# EAGLE design M220at (EAGLE 6.6.0)
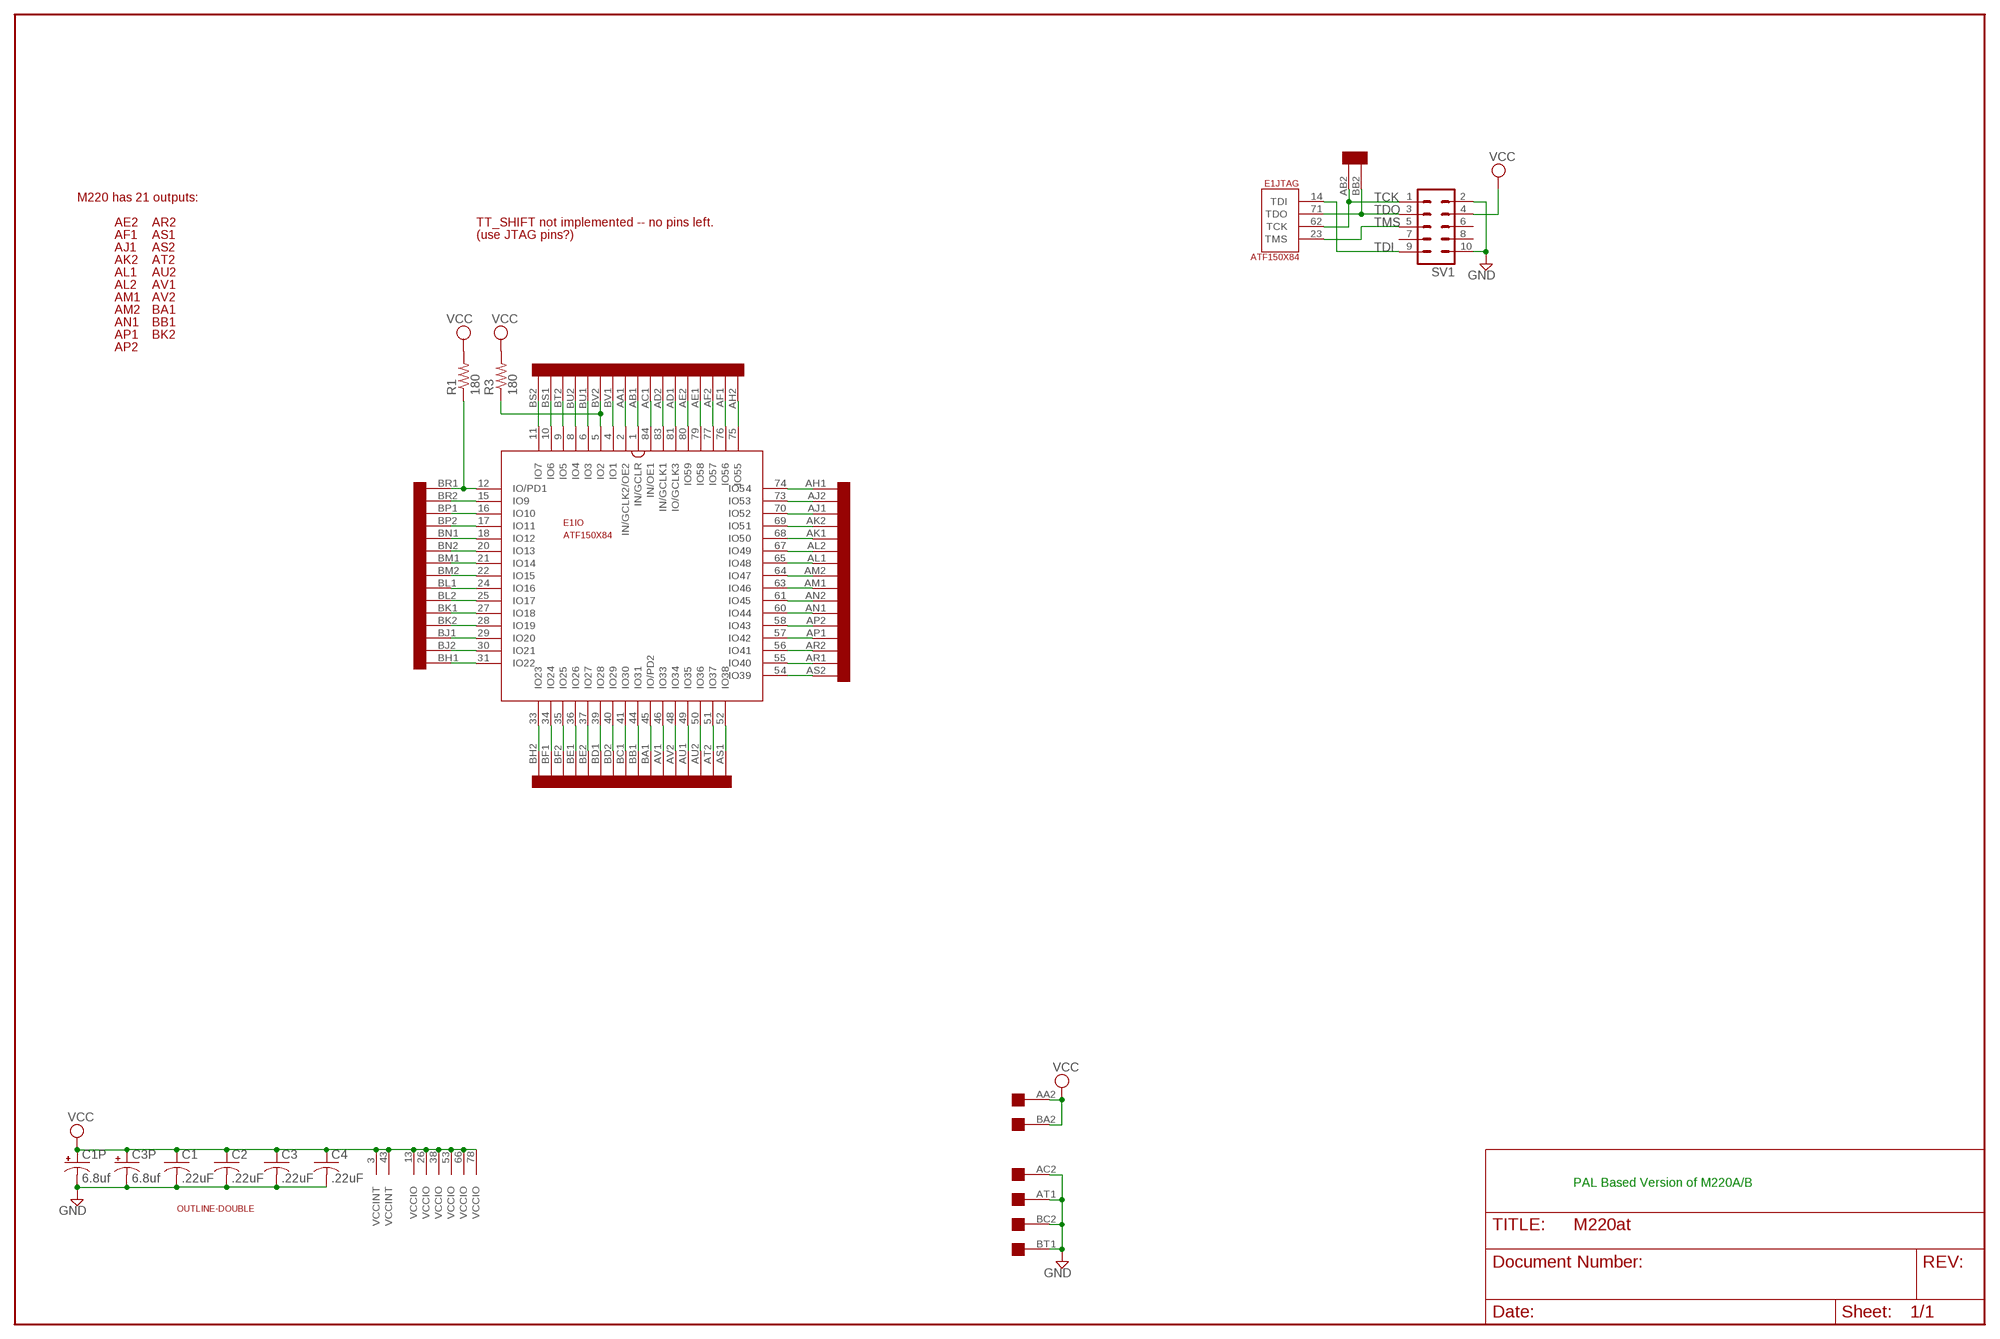
[diagram p0: schematic, sheet 1]

## Parts
C1  .22uF  C-US050-025X075  [C050-025X075]
C1P  6.8uf  CPOL-USE15-5AXIAL  [E15-5]
C2  .22uF  C-US050-025X075  [C050-025X075]
C3  .22uF  C-US050-025X075  [C050-025X075]
C3P  6.8uf  CPOL-USE15-5AXIAL  [E15-5]
C4  .22uF  C-US050-025X075  [C050-025X075]
E1  ATF150X84  [S84]
R1  180  R-US_0207/10  [0207/10]
R3  180  R-US_0207/10  [0207/10]
SV1  ML10  [ML10]
U$1  DOUBLE  [EDGE-CON4]
U$2  OUTLINE-DOUBLE  [DOUBLE]

## Nets
AA1: E1.2(IO:IN/GCLK2/OE2) U$1.AA1
AB1: E1.1(IO:IN/GCLR) U$1.AB1
AC1: E1.84(IO:IN/OE1) U$1.AC1
AD1: E1.81(IO:IO/GCLK3) U$1.AD1
AD2: E1.83(IO:IN/GCLK1) U$1.AD2
AE1: E1.79(IO:IO58) U$1.AE1
AE2: E1.80(IO:IO59) U$1.AE2
AF1: E1.76(IO:IO56) U$1.AF1
AF2: E1.77(IO:IO57) U$1.AF2
AH1: E1.74(IO:IO54) U$1.AH1
AH2: E1.75(IO:IO55) U$1.AH2
AJ1: E1.70(IO:IO52) U$1.AJ1
AJ2: E1.73(IO:IO53) U$1.AJ2
AK1: E1.68(IO:IO50) U$1.AK1
AK2: E1.69(IO:IO51) U$1.AK2
AL1: E1.65(IO:IO48) U$1.AL1
AL2: E1.67(IO:IO49) U$1.AL2
AM1: E1.63(IO:IO46) U$1.AM1
AM2: E1.64(IO:IO47) U$1.AM2
AN1: E1.60(IO:IO44) U$1.AN1
AN2: E1.61(IO:IO45) U$1.AN2
AP1: E1.57(IO:IO42) U$1.AP1
AP2: E1.58(IO:IO43) U$1.AP2
AR1: E1.55(IO:IO40) U$1.AR1
AR2: E1.56(IO:IO41) U$1.AR2
AS1: E1.52(IO:IO38) U$1.AS1
AS2: E1.54(IO:IO39) U$1.AS2
AT2: E1.51(IO:IO37) U$1.AT2
AU1: E1.49(IO:IO35) U$1.AU1
AU2: E1.50(IO:IO36) U$1.AU2
AV1: E1.46(IO:IO33) U$1.AV1
AV2: E1.48(IO:IO34) U$1.AV2
BA1: E1.45(IO:IO/PD2) U$1.BA1
BB1: E1.44(IO:IO31) U$1.BB1
BC1: E1.41(IO:IO30) U$1.BC1
BD1: E1.39(IO:IO28) U$1.BD1
BD2: E1.40(IO:IO29) U$1.BD2
BE1: E1.36(IO:IO26) U$1.BE1
BE2: E1.37(IO:IO27) U$1.BE2
BF1: E1.34(IO:IO24) U$1.BF1
BF2: E1.35(IO:IO25) U$1.BF2
BH1: E1.31(IO:IO22) U$1.BH1
BH2: E1.33(IO:IO23) U$1.BH2
BJ1: E1.29(IO:IO20) U$1.BJ1
BJ2: E1.30(IO:IO21) U$1.BJ2
BK1: E1.27(IO:IO18) U$1.BK1
BK2: E1.28(IO:IO19) U$1.BK2
BL1: E1.24(IO:IO16) U$1.BL1
BL2: E1.25(IO:IO17) U$1.BL2
BM1: E1.21(IO:IO14) U$1.BM1
BM2: E1.22(IO:IO15) U$1.BM2
BN1: E1.18(IO:IO12) U$1.BN1
BN2: E1.20(IO:IO13) U$1.BN2
BP1: E1.16(IO:IO10) U$1.BP1
BP2: E1.17(IO:IO11) U$1.BP2
BR1: E1.12(IO:IO/PD1) R1.1 U$1.BR1
BR2: E1.15(IO:IO9) U$1.BR2
BS1: E1.10(IO:IO6) U$1.BS1
BS2: E1.11(IO:IO7) U$1.BS2
BT2: E1.9(IO:IO5) U$1.BT2
BU1: E1.6(IO:IO3) U$1.BU1
BU2: E1.8(IO:IO4) U$1.BU2
BV1: E1.4(IO:IO1) U$1.BV1
BV2: E1.5(IO:IO2) R3.1 U$1.BV2
GND [Supply]: C1.2 C1P.- C2.2 C3.2 C3P.- C4.2 SV1.2 SV1.10 U$1.AC2 U$1.AT1 U$1.BC2 U$1.BT1
TCK: E1.62(JTAG:TCK) SV1.1 U$1.AB2
TDI: E1.14(JTAG:TDI) SV1.9
TDO: E1.71(JTAG:TDO) SV1.3 U$1.BB2
TMS: E1.23(JTAG:TMS) SV1.5
VCC [Supply]: C1.1 C1P.+ C2.1 C3.1 C3P.+ C4.1 E1.3(VCCINT) E1.13(VCCIO) E1.26(VCCIO) E1.38(VCCIO) E1.43(VCCINT) E1.53(VCCIO) E1.66(VCCIO) E1.78(VCCIO) R1.2 R3.2 SV1.4 U$1.AA2 U$1.BA2
Unconnected: SV1.6 SV1.7 SV1.8

## Notes on the sheet
- M220 has 21 outputs:
- AE2 | AR2 | TT_SHIFT not implemented -- no pins left.
- AF1 | AS1 | (use JTAG pins?)
- AJ1 | AS2
- AK2 | AT2
- AL1 | AU2
- AL2 | AV1
- AM1 | AV2
- AM2 | BA1
- AN1 | BB1
- AP1 | BK2
- AP2
- PAL Based Version of M220A/B

## Power pins joined to a net without a drawn wire
GND: E1.7(GND) E1.19(GND) E1.32(GND) E1.42(GND) E1.47(GND) E1.59(GND) E1.72(GND) E1.82(GND)

## Library data of the parts
C1-C4 = rcl:C-US: CAPACITOR, American symbol
C1P C3P = rcl:CPOL-US: POLARIZED CAPACITOR, American symbol
E1 = atmel-cpld:ATF150X84: ATF150x in 84 pin package.
R1 R3 = rcl:R-US_: RESISTOR, American symbol
SV1 = con-harting-ml:ML10: HARTING; OC_FARNELL: unknown; OC_NEWARK: unknown
U$1 = dec-con:DOUBLE: Double-Height DEC board
U$2 = dec-con:OUTLINE-*: Board outlines for DEC boards.

## Net classes
1 Supply: width 0.711 mm

## Board
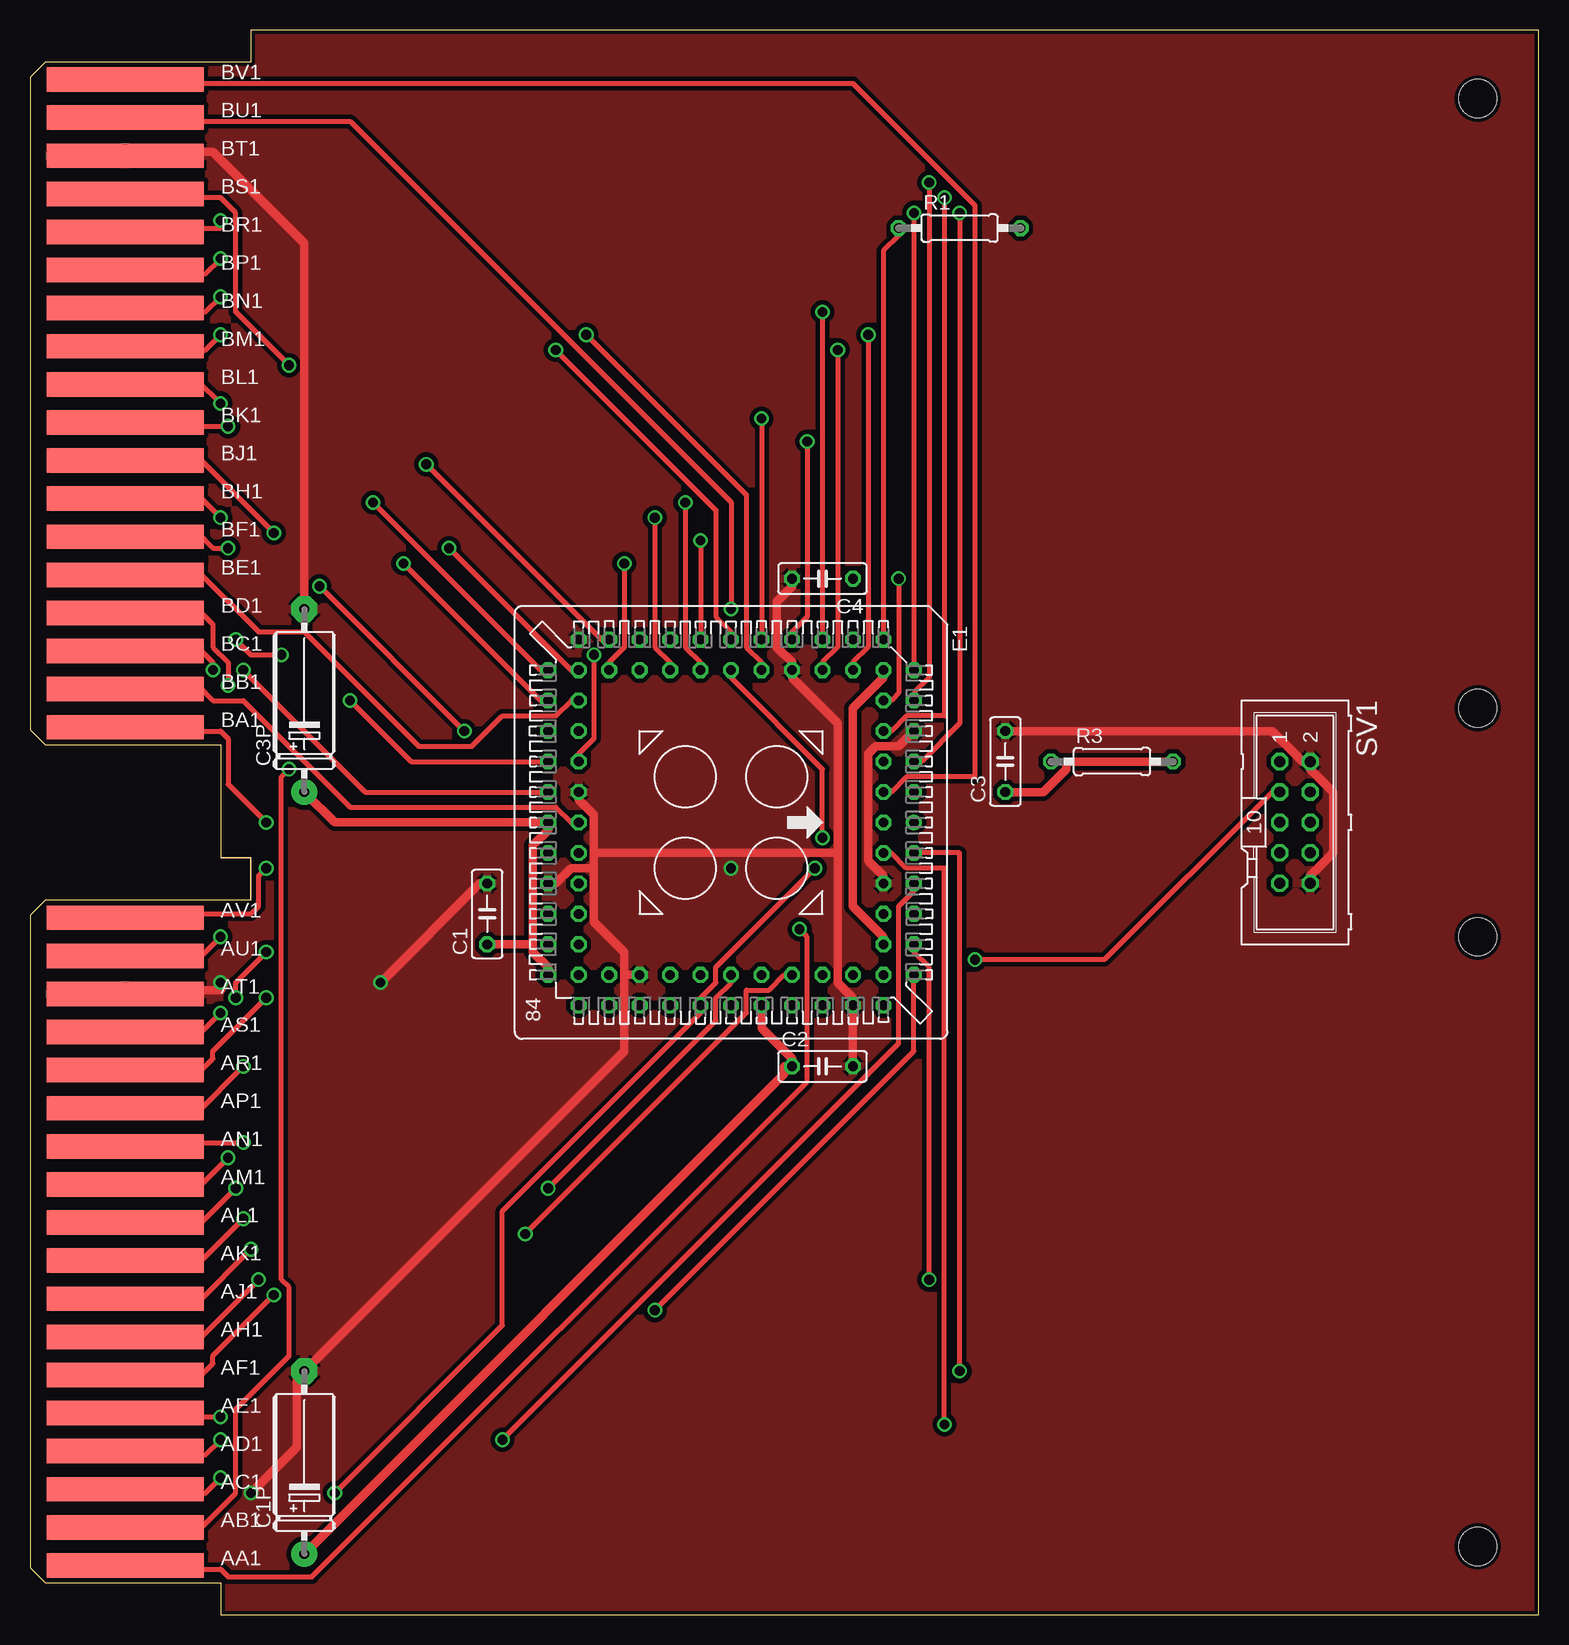
[diagram p1: board, top side]
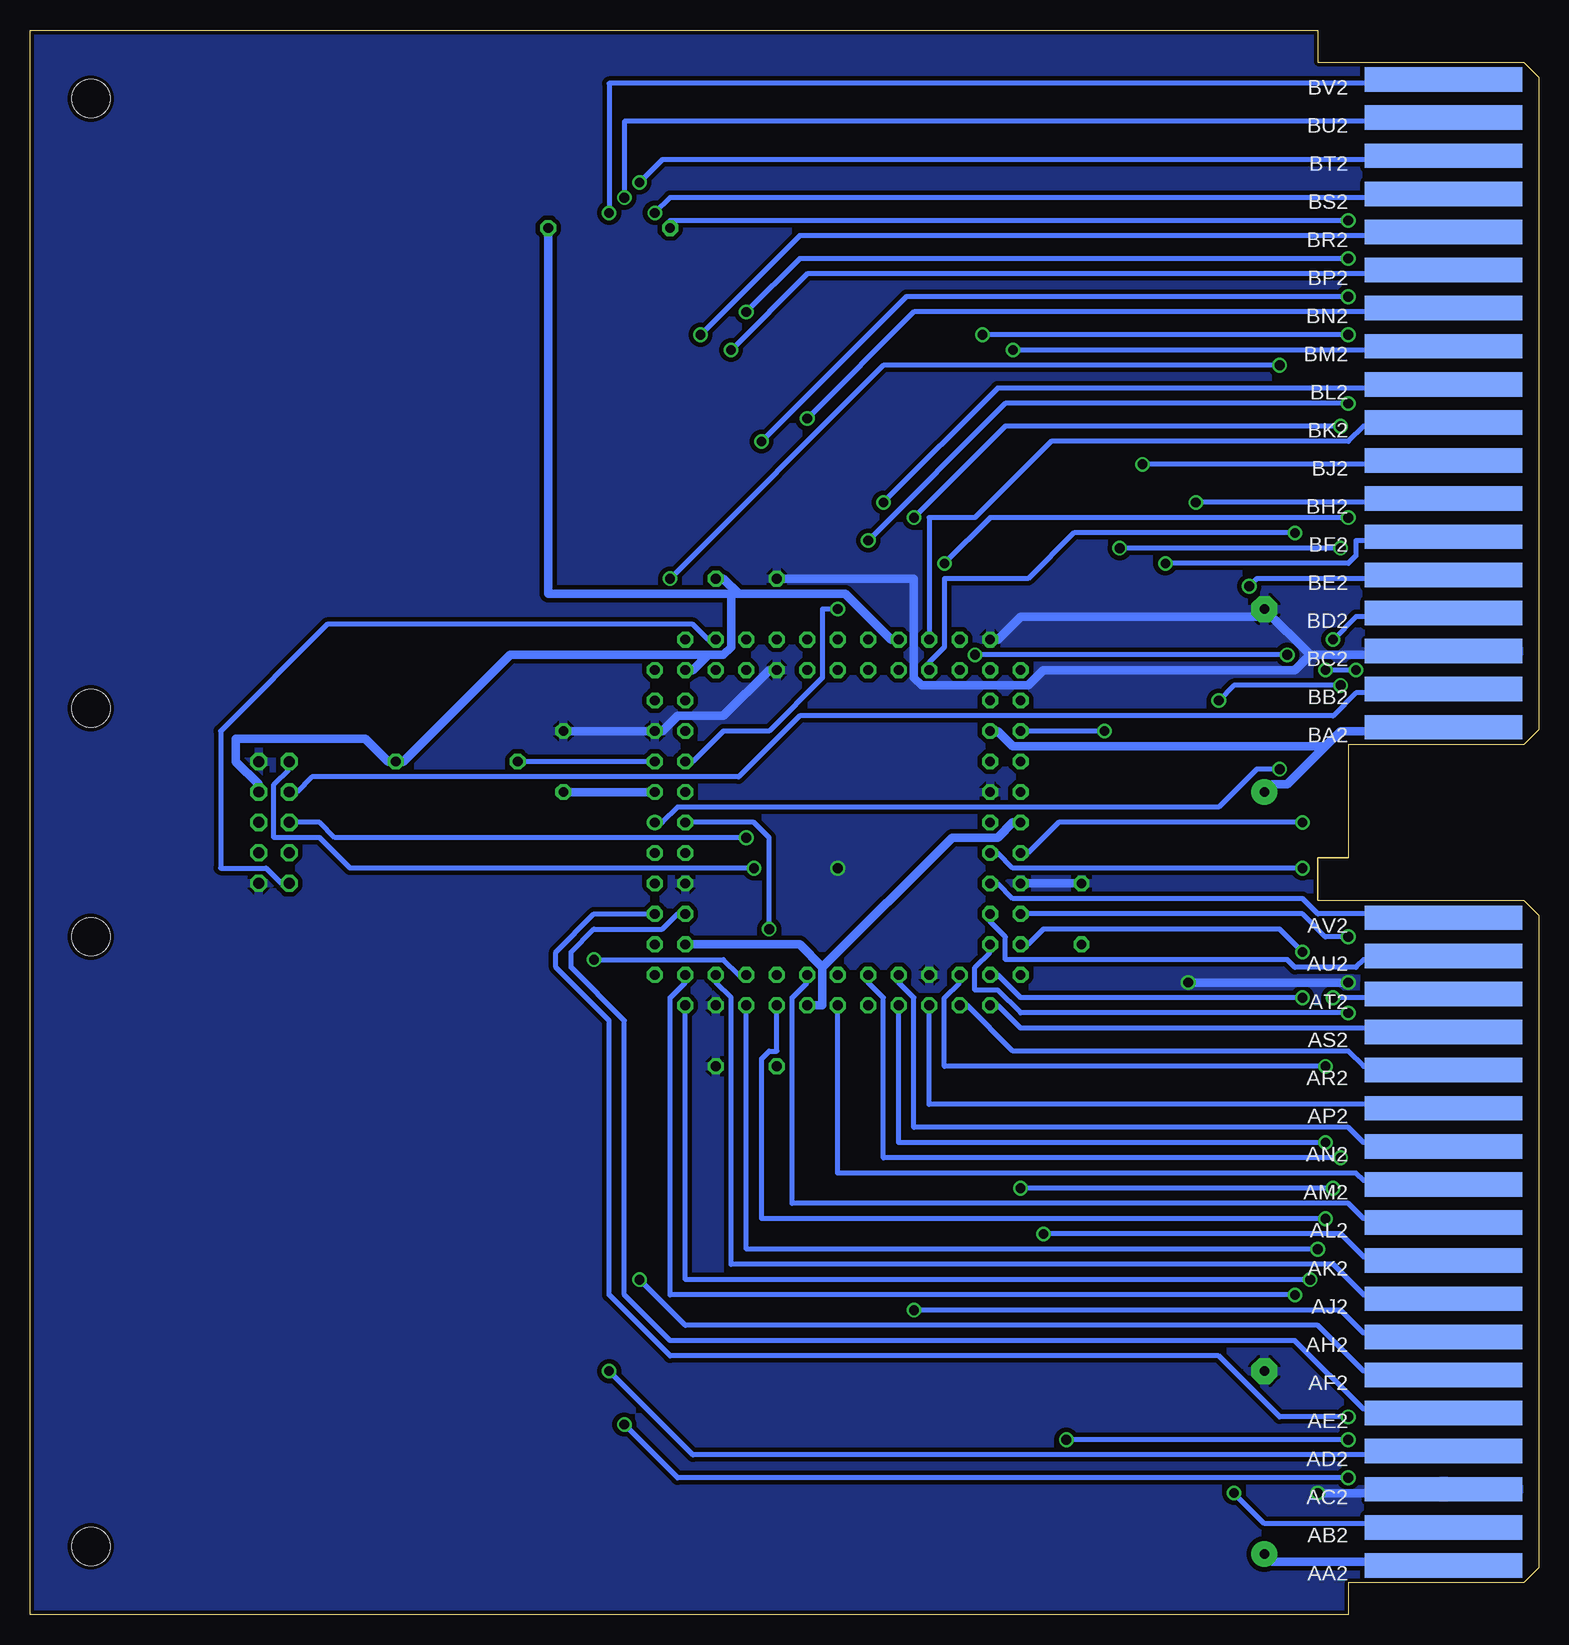
[diagram p2: board, bottom side, seen from below]

Size 125.73 x 132.08 mm. Coordinates in mm from the lower left corner, seen from the top.
Copper layers (1+16): Top 0.035mm / dielectric 1.5mm / Bottom 0.035mm
Design rules "16mils": minimum track width 16mil, minimum drill 32mil, track to track 15mil, track to pad 10mil, pad to pad 10mil, via to via 10mil, smd to smd 10mil, copper to edge 13mil, drill to drill 10mil, minimum pad ring 10mil, minimum via ring 8mil, stop-mask expansion 0mil, vias tented up to drill 0mil, thermal gap 10mil

### Footprints (pad centres in the part's own frame; a part is rotated, then mirrored left to right if it is on the bottom)
C050-025X075 = drill 0.813 octagon: 1 -2.54,0; 2 2.54,0
E15-5 = drill 0.813 pad 2.159: + -7.62,0 | drill 0.813 pad 2.159 octagon: - 7.62,0
S84 = drill 0.813: 1 0,15.24 | drill 0.813 octagon: 2 0,12.7; 3 -2.54,15.24; 4 -2.54,12.7; 5 -5.08,15.24; 6 -5.08,12.7; 7 -7.62,15.24; 8 -7.62,12.7; 9 -10.16,15.24; 10 -10.16,12.7; 11 -12.7,15.24; 12 -15.24,12.7; 13 -12.7,12.7; 14 -15.24,10.16; 15 -12.7,10.16; 16 -15.24,7.62; 17 -12.7,7.62; 18 -15.24,5.08; 19 -12.7,5.08; 20 -15.24,2.54; 21 -12.7,2.54; 22 -15.24,0; 23 -12.7,0; 24 -15.24,-2.54; 25 -12.7,-2.54; 26 -15.24,-5.08; 27 -12.7,-5.08; 28 -15.24,-7.62; 29 -12.7,-7.62; 30 -15.24,-10.16; 31 -12.7,-10.16; 32 -15.24,-12.7; 33 -12.7,-15.24; 34 -12.7,-12.7; 35 -10.16,-15.24; 36 -10.16,-12.7; 37 -7.62,-15.24; 38 -7.62,-12.7; 39 -5.08,-15.24; 40 -5.08,-12.7; 41 -2.54,-15.24; 42 -2.54,-12.7; 43 0,-15.24; 44 0,-12.7; 45 2.54,-15.24; 46 2.54,-12.7; 47 5.08,-15.24; 48 5.08,-12.7; 49 7.62,-15.24; 50 7.62,-12.7; 51 10.16,-15.24; 52 10.16,-12.7; 53 12.7,-15.24; 54 15.24,-12.7; 55 12.7,-12.7; 56 15.24,-10.16; 57 12.7,-10.16; 58 15.24,-7.62; 59 12.7,-7.62; 60 15.24,-5.08; 61 12.7,-5.08; 62 15.24,-2.54; 63 12.7,-2.54; 64 15.24,0; 65 12.7,0; 66 15.24,2.54; 67 12.7,2.54; 68 15.24,5.08; 69 12.7,5.08; 70 15.24,7.62; 71 12.7,7.62; 72 15.24,10.16; 73 12.7,10.16; 74 15.24,12.7; 75 12.7,15.24; 76 12.7,12.7; 77 10.16,15.24; 78 10.16,12.7; 79 7.62,15.24; 80 7.62,12.7; 81 5.08,15.24; 82 5.08,12.7; 83 2.54,15.24; 84 2.54,12.7
0207/10 = drill 0.813 octagon: 1 -5.08,0; 2 5.08,0
ML10 = drill 0.914 octagon: 1 -5.08,-1.27; 2 -5.08,1.27; 3 -2.54,-1.27; 4 -2.54,1.27; 5 0,-1.27; 6 0,1.27; 7 2.54,-1.27; 8 2.54,1.27; 9 5.08,-1.27; 10 5.08,1.27
EDGE-CON4 = smd 13.106 x 2.032: AA1 7.938,4.128; AB1 7.938,7.303; AC1 7.938,10.477; AD1 7.938,13.652; AE1 7.938,16.828; AF1 7.938,20.003; AH1 7.938,23.177; AJ1 7.938,26.352; AK1 7.938,29.527; AL1 7.938,32.703; AM1 7.938,35.877; AN1 7.938,39.053; AP1 7.938,42.227; AR1 7.938,45.403; AS1 7.938,48.578; AT1 7.938,51.752; AU1 7.938,54.928; AV1 7.938,58.102; BA1 7.938,73.978; BB1 7.938,77.153; BC1 7.938,80.328; BD1 7.938,83.502; BE1 7.938,86.677; BF1 7.938,89.853; BH1 7.938,93.028; BJ1 7.938,96.203; BK1 7.938,99.377; BL1 7.938,102.552; BM1 7.938,105.728; BN1 7.938,108.903; BP1 7.938,112.078; BR1 7.938,115.252; BS1 7.938,118.427; BT1 7.938,121.603; BU1 7.938,124.778; BV1 7.938,127.953 | smd 13.106 x 2.032 bottom: AA2 7.938,4.128; AB2 7.938,7.303; AC2 7.938,10.477; AD2 7.938,13.652; AE2 7.938,16.828; AF2 7.938,20.003; AH2 7.938,23.177; AJ2 7.938,26.352; AK2 7.938,29.527; AL2 7.938,32.703; AM2 7.938,35.877; AN2 7.938,39.053; AP2 7.938,42.227; AR2 7.938,45.403; AS2 7.938,48.578; AT2 7.938,51.752; AU2 7.938,54.928; AV2 7.938,58.102; BA2 7.938,73.978; BB2 7.938,77.153; BC2 7.938,80.328; BD2 7.938,83.502; BE2 7.938,86.677; BF2 7.938,89.853; BH2 7.938,93.028; BJ2 7.938,96.203; BK2 7.938,99.377; BL2 7.938,102.552; BM2 7.938,105.728; BN2 7.938,108.903; BP2 7.938,112.078; BR2 7.938,115.252; BS2 7.938,118.427; BT2 7.938,121.603; BU2 7.938,124.778; BV2 7.938,127.953
DOUBLE = hole 3.175: 120.65,56.515; 120.65,5.715; 120.65,75.565; 120.65,126.365

### Placement (x,y rotation side)
C1  38.1,58.42 90 top
C1P  22.86,12.7 90 top
C2  66.04,45.72 0 top
C3  81.28,71.12 90 top
C3P  22.86,76.2 90 top
C4  66.04,86.36 180 top
E1  58.42,66.04 270 top
R1  77.47,115.57 0 top
R3  90.17,71.12 0 top
SV1  105.41,66.04 270 top
U$1  0,0 0 top
U$2  0,0 0 top

### Tracks (layer width: path | path; a pad name or v marks a point on that pad's centre or on a via)
AA1  (via drill 0.81)
  Top 0.406: v64.14,57.15 64.77,56.52 64.77,44.45 23.5,3.17 16.51,3.17 15.88,3.81 13.97,3.81 U$1.AA1
  Bottom 0.406: v64.14,57.15 64.14,64.77 65.41,66.04 E1.2
AB1  (via drill 0.81)
  Top 0.406: v21.59,70.48 20.96,69.85 20.96,27.94 21.59,27.3 21.59,21.59 17.15,17.14 17.15,10.16 13.97,6.99 U$1.AB1
  Bottom 0.406: v21.59,70.48 23.5,70.48 26.67,67.31 71.76,67.31 73.03,66.04 E1.1
AC1  (via drill 0.81)
  Top 0.406: v76.2,15.88 76.2,62.23 73.03,62.23 71.76,63.5 E1.84 | v15.88,11.43 14.61,10.16 13.97,10.16 U$1.AC1
  Bottom 0.406: v76.2,15.88 71.76,11.43 v15.88,11.43
AD1  (via drill 0.81)
  Top 0.406: v39.37,14.61 72.39,47.62 72.39,59.05 73.66,60.33 E1.81 | v15.88,14.61 14.61,13.34 13.97,13.34 U$1.AD1
  Bottom 0.406: v15.88,14.61 v39.37,14.61
AD2  (via drill 0.81)
  Top 0.406: v77.47,20.32 77.47,63.5 E1.83
  Bottom 0.406: v77.47,20.32 70.49,13.34 13.97,13.34 U$1.AD2
AE1  (via drill 0.81)
  Top 0.406: v15.88,16.51 13.97,16.51 U$1.AE1
  Bottom 0.406: v15.88,16.51 21.59,16.51 26.67,21.59 72.39,21.59 77.47,26.67 77.47,49.53 81.92,53.98 81.92,55.24 78.74,58.42 E1.79
AE2
  Bottom 0.406: E1.80 71.76,58.42 73.03,57.15 78.74,57.15 80.65,55.24 80.65,53.98 76.2,49.53 76.2,26.67 72.39,22.86 20.32,22.86 14.61,17.14 13.97,17.14 U$1.AE2
AF1  (via drill 0.81)
  Top 0.406: v20.32,26.67 15.24,21.59 15.24,20.95 13.97,19.68 U$1.AF1
  Bottom 0.406: v20.32,26.67 72.39,26.67 72.39,51.44 71.12,52.7 E1.76
AF2  (via drill 0.81)
  Top 0.406: v74.93,27.94 74.93,53.98 73.66,55.24 E1.77
  Bottom 0.406: v74.93,27.94 71.12,24.13 18.42,24.13 14.61,20.32 13.97,20.32 U$1.AF2
AH1  (via drill 0.81)
  Top 0.406: v19.05,27.94 13.97,22.86 U$1.AH1
  Bottom 0.406: v19.05,27.94 71.12,27.94 E1.74
AH2  (via drill 0.81)
  Top 0.406: v52.07,25.4 73.66,46.99 E1.75
  Bottom 0.406: v52.07,25.4 16.51,25.4 14.61,23.5 13.97,23.5 U$1.AH2
AJ1  (via drill 0.81)
  Top 0.406: v18.42,30.48 13.97,26.04 U$1.AJ1
  Bottom 0.406: v18.42,30.48 66.04,30.48 E1.70
AJ2
  Bottom 0.406: E1.73 68.58,52.7 67.31,51.44 67.31,29.21 17.15,29.21 14.61,26.67 13.97,26.67 U$1.AJ2
AK1  (via drill 0.81)
  Top 0.406: v17.78,33.02 13.97,29.21 U$1.AK1
  Bottom 0.406: v17.78,33.02 64.77,33.02 64.77,46.35 64.14,46.99 63.5,46.99 E1.68
AK2  (via drill 0.81)
  Top 0.406: v41.28,31.75 59.69,50.16 59.69,52.07 61.6,52.07 62.87,53.34 E1.69
  Bottom 0.406: v41.28,31.75 16.51,31.75 14.61,29.84 13.97,29.84 U$1.AK2
AL1  (via drill 0.81)
  Top 0.406: v43.18,35.56 57.15,49.53 57.15,51.44 58.42,52.7 E1.65 | v17.15,35.56 13.97,32.38 U$1.AL1
  Bottom 0.406: v17.15,35.56 v43.18,35.56
AL2
  Bottom 0.406: E1.67 60.96,52.7 62.23,51.44 62.23,34.29 15.88,34.29 14.61,33.02 13.97,33.02 U$1.AL2
AM1  (via drill 0.81)
  Top 0.406: v16.51,38.1 13.97,35.56 U$1.AM1
  Bottom 0.406: v16.51,38.1 54.61,38.1 54.61,51.44 55.88,52.7 E1.63
AM2
  Bottom 0.406: E1.64 58.42,36.83 15.24,36.83 14.61,36.2 13.97,36.2 U$1.AM2
AN1  (via drill 0.81)
  Top 0.406: v17.78,39.37 13.97,39.37 U$1.AN1
  Bottom 0.406: v17.78,39.37 53.34,39.37 E1.60
AN2
  Bottom 0.406: E1.61 53.34,52.7 52.07,51.44 52.07,40.64 15.88,40.64 14.61,39.37 13.97,39.37 U$1.AN2
AP1  (via drill 0.81)
  Top 0.406: v17.78,45.72 13.97,41.91 U$1.AP1
  Bottom 0.406: v17.78,45.72 49.53,45.72 49.53,51.44 48.26,52.7 E1.57
AP2
  Bottom 0.406: E1.58 50.8,42.55 13.97,42.55 U$1.AP2
AR1  (via drill 0.81)
  Top 0.406: v19.69,51.44 15.24,46.99 15.24,46.35 13.97,45.09 U$1.AR1
  Bottom 0.406: v19.69,51.44 43.18,51.44 45.09,53.34 E1.55
AR2
  Bottom 0.406: E1.56 47.63,50.8 43.82,46.99 15.88,46.99 14.61,45.72 13.97,45.72 U$1.AR2
AS1  (via drill 0.81)
  Top 0.406: v15.88,50.16 13.97,48.26 U$1.AS1
  Bottom 0.406: v15.88,50.16 43.18,50.16 45.09,52.07 46.99,52.07 46.99,53.98 45.72,55.24 E1.52
AS2
  Bottom 0.406: E1.54 45.09,50.8 43.18,48.9 13.97,48.9 U$1.AS2
AT2  (via drill 0.81)
  Top 0.406: v19.69,55.24 17.15,52.7 v17.15,51.44
  Bottom 0.406: v19.69,55.24 21.59,57.15 41.28,57.15 42.55,55.88 E1.51 | v17.15,51.44 13.97,51.44 U$1.AT2
AU1  (via drill 0.81)
  Top 0.406: v15.88,56.52 13.97,54.61 U$1.AU1
  Bottom 0.406: v15.88,56.52 17.78,56.52 19.69,58.42 E1.49
AU2
  Bottom 0.406: E1.50 45.72,57.78 44.45,56.52 44.45,54.61 20.96,54.61 20.32,53.98 15.24,53.98 14.61,54.61 13.97,54.61 U$1.AU2
AV1  (via drill 0.81)
  Top 0.406: v19.69,62.23 19.05,61.59 19.05,59.05 18.42,58.42 13.97,58.42 U$1.AV1
  Bottom 0.406: v19.69,62.23 43.82,62.23 45.09,63.5 E1.46
AV2
  Bottom 0.406: E1.48 45.09,60.96 43.82,59.69 19.69,59.69 18.42,58.42 13.97,58.42 U$1.AV2
BA1  (via drill 0.81)
  Top 0.406: v19.69,66.04 16.51,69.22 16.51,73.03 15.88,73.66 13.97,73.66 U$1.BA1
  Bottom 0.406: v19.69,66.04 40.01,66.04 42.55,63.5 E1.45
BB1
  Top 0.406: E1.44 45.09,66.04 43.82,67.31 26.67,67.31 17.78,76.2 15.24,76.2 13.97,77.47 U$1.BB1
BC1  (via drill 0.81)
  Top 0.406: v17.78,78.74 27.94,68.58 E1.41 | v15.24,78.74 15.24,79.38 13.97,80.64 U$1.BC1
  Bottom 0.406: v15.24,78.74 v17.78,78.74
BD1  (via drill 0.81)
  Top 0.406: v26.67,76.2 31.75,71.12 E1.39 | v16.51,77.47 16.51,79.38 15.24,80.64 15.24,82.55 13.97,83.82 U$1.BD1
  Bottom 0.406: v26.67,76.2 25.4,77.47 v16.51,77.47
BD2  (via drill 0.81)
  Top 0.406: v46.99,80.01 46.99,73.03 45.72,71.75 E1.40 | v20.96,80.01 18.42,80.01 v17.15,81.28
  Bottom 0.406: v20.96,80.01 v46.99,80.01 | v17.15,81.28 15.24,83.19 13.97,83.19 U$1.BD2
BE1
  Top 0.406: E1.36 45.09,76.2 43.82,74.93 39.37,74.93 36.83,72.39 32.39,72.39 22.86,81.92 19.05,81.92 13.97,87 U$1.BE1
BE2  (via drill 0.81)
  Top 0.406: v24.13,85.72 v36.2,73.66
  Bottom 0.406: v24.13,85.72 23.5,86.36 13.97,86.36 U$1.BE2 | v36.2,73.66 E1.37
BF1  (via drill 0.81)
  Top 0.406: v34.93,88.9 45.09,78.74 E1.34 | v16.51,88.9 15.24,88.9 13.97,90.17 U$1.BF1
  Bottom 0.406: v16.51,88.9 v34.93,88.9
BF2  (via drill 0.81)
  Top 0.406: v31.12,87.63 42.55,76.2 E1.35
  Bottom 0.406: v31.12,87.63 15.88,87.63 15.24,88.27 15.24,89.53 13.97,89.53 U$1.BF2
BH1  (via drill 0.81)
  Top 0.406: v49.53,87.63 49.53,80.64 48.26,79.38 E1.31 | v15.88,91.44 13.97,93.34 U$1.BH1
  Bottom 0.406: v49.53,87.63 45.72,91.44 v15.88,91.44
BH2  (via drill 0.81)
  Top 0.406: v28.58,92.71 42.55,78.74 E1.33
  Bottom 0.406: v28.58,92.71 13.97,92.71 U$1.BH2
BJ1  (via drill 0.81)
  Top 0.406: v20.32,90.17 13.97,96.52 U$1.BJ1
  Bottom 0.406: v20.32,90.17 38.74,90.17 42.55,86.36 49.53,86.36 49.53,80.64 50.8,79.38 E1.29
BJ2  (via drill 0.81)
  Top 0.406: v33.02,95.89 47.63,81.28 E1.30
  Bottom 0.406: v33.02,95.89 13.97,95.89 U$1.BJ2
BK1  (via drill 0.81)
  Top 0.406: v52.07,91.44 52.07,80.64 53.34,79.38 E1.27 | v16.51,99.06 13.97,99.06 U$1.BK1
  Bottom 0.406: v52.07,91.44 44.45,99.06 v16.51,99.06
BK2
  Bottom 0.406: E1.28 50.8,91.44 46.99,91.44 40.64,97.79 15.88,97.79 14.61,99.06 13.97,99.06 U$1.BK2
BL1  (via drill 0.81)
  Top 0.406: v15.88,100.97 13.97,102.87 U$1.BL1 | v55.88,89.53 E1.24
  Bottom 0.406: v55.88,89.53 44.45,100.97 v15.88,100.97
BL2  (via drill 0.81)
  Top 0.406: v54.61,92.71 54.61,80.64 55.88,79.38 E1.25
  Bottom 0.406: v54.61,92.71 45.09,102.23 13.97,102.23 U$1.BL2
BM1  (via drill 0.81)
  Top 0.406: v46.36,106.68 59.69,93.34 59.69,80.64 60.96,79.38 E1.21 | v15.88,106.68 14.61,105.41 13.97,105.41 U$1.BM1
  Bottom 0.406: v15.88,106.68 v46.36,106.68
BM2  (via drill 0.81)
  Top 0.406: v43.82,105.41 57.15,92.08 57.15,83.19 58.42,81.92 E1.22
  Bottom 0.406: v43.82,105.41 13.97,105.41 U$1.BM2
BN1  (via drill 0.81)
  Top 0.406: v64.77,97.79 64.77,83.19 63.5,81.92 E1.18 | v15.88,109.86 14.61,108.58 13.97,108.58 U$1.BN1
  Bottom 0.406: v64.77,97.79 52.71,109.86 v15.88,109.86
BN2  (via drill 0.81)
  Top 0.406: v60.96,99.69 E1.20
  Bottom 0.406: v60.96,99.69 52.07,108.58 13.97,108.58 U$1.BN2
BP1  (via drill 0.81)
  Top 0.406: v15.88,113.03 14.61,111.76 13.97,111.76 U$1.BP1 | v66.04,108.58 E1.16
  Bottom 0.406: v66.04,108.58 61.6,113.03 v15.88,113.03
BP2  (via drill 0.81)
  Top 0.406: v67.31,105.41 67.31,80.64 66.04,79.38 E1.17
  Bottom 0.406: v67.31,105.41 60.96,111.76 13.97,111.76 U$1.BP2
BR1  (via drill 0.81)
  Top 0.406: E1.12 71.12,113.67 72.39,114.94 R1.1 | v15.88,116.2 15.88,115.57 13.97,115.57 U$1.BR1
  Bottom 0.406: v15.88,116.2 72.39,116.2 R1.1
BR2  (via drill 0.81)
  Top 0.406: v69.85,106.68 69.85,80.64 68.58,79.38 E1.15
  Bottom 0.406: v69.85,106.68 61.6,114.94 13.97,114.94 U$1.BR2
BS1  (via drill 0.81)
  Top 0.406: v72.39,86.36 72.39,76.83 71.76,76.2 E1.10 | v21.59,104.14 17.15,108.58 17.15,116.84 15.88,118.11 13.97,118.11 U$1.BS1
  Bottom 0.406: v72.39,86.36 54.61,104.14 v21.59,104.14
BS2  (via drill 0.81)
  Top 0.406: v73.66,116.84 E1.11
  Bottom 0.406: v73.66,116.84 72.39,118.11 13.97,118.11 U$1.BS2
BT2  (via drill 0.81)
  Top 0.406: v74.93,119.38 74.93,78.11 73.66,76.83 E1.9
  Bottom 0.406: v74.93,119.38 73.03,121.28 13.97,121.28 U$1.BT2
BU1  (via drill 0.81)
  Top 0.406: v58.42,83.82 58.42,92.71 26.67,124.46 13.97,124.46 U$1.BU1
  Bottom 0.406: v58.42,83.82 59.69,83.82 59.69,78.11 64.14,73.66 67.95,73.66 70.49,71.12 E1.6
BU2  (via drill 0.81)
  Top 0.406: v76.2,118.11 76.2,74.93 73.03,74.93 71.76,73.66 E1.8
  Bottom 0.406: v76.2,118.11 76.2,124.46 13.97,124.46 U$1.BU2
BV1
  Top 0.406: E1.4 71.76,68.58 73.03,69.85 78.74,69.85 78.74,117.47 68.58,127.64 13.97,127.64 U$1.BV1
BV2  (via drill 0.81)
  Top 0.406: v77.47,116.84 77.47,74.3 74.3,71.12 E1.5
  Bottom 0.406: E1.5 R3.1 | v77.47,116.84 77.47,127.64 13.97,127.64 U$1.BV2
GND  (via drill 0.81)
  Top 0.711: U$1.BT1 8.89,121.92 15.24,121.92 22.86,114.3 C3P.- | C2.2 E1.72 68.58,51.44 67.31,52.7 67.31,63.5 | C4.2 63.5,85.72 62.23,84.45 62.23,80.64 63.5,79.38 E1.19 63.5,78.11 67.31,74.3 67.31,63.5 | SV1.10 106.68,61.59 108.59,63.5 108.59,68.58 106.68,70.48 SV1.2 106.05,71.12 103.51,73.66 C3.2 | E1.82 71.12,61.59 69.85,62.87 69.85,71.75 70.49,72.39 72.39,72.39 E1.7 | 46.99,63.5 46.99,66.67 45.72,67.94 E1.42 | 46.99,62.23 46.99,63.5 | 46.99,62.23 46.99,57.78 49.53,55.24 49.53,53.34 | 49.53,53.34 E1.59 | 49.53,53.34 49.53,46.99 C1P.- 22.23,19.68 22.23,13.97 v18.42,10.16 | 46.99,62.23 45.09,62.23 43.82,60.96 E1.47 | 46.99,63.5 67.31,63.5 | v15.88,52.7 15.88,52.07 13.97,52.07 U$1.AT1 | v29.21,52.7 37.47,60.96 C1.2
  Bottom 0.711: E1.32 45.09,81.28 43.18,83.19 23.5,83.19 C3P.- 19.05,80.01 | 19.05,80.01 13.97,80.01 U$1.BC2 | C3.2 E1.7 73.03,73.66 71.76,74.93 67.95,74.93 64.14,78.74 E1.19 | E1.47 C1.2 | v18.42,10.16 13.97,10.16 U$1.AC2 | 19.05,80.01 20.32,78.74 41.28,78.74 42.55,77.47 51.44,77.47 52.07,78.11 52.07,86.36 C4.2 | v29.21,52.7 v15.88,52.7
  other vias: 58.42,62.23
  pour Bottom: 0,0 125.73,0 125.73,132.08 0,132.08
  pour Top: 0,0 125.73,0 125.73,132.08 0,132.08
TCK  (via drill 0.81)
  Top 0.406: v25.4,10.16 39.37,24.13 39.37,33.66 55.88,50.16 E1.62 55.88,51.44 57.15,52.7 57.15,53.98 v65.41,62.23
  Bottom 0.406: v25.4,10.16 22.86,7.62 13.97,7.62 U$1.AB2 | v65.41,62.23 99.06,62.23 101.6,64.77 105.41,64.77 105.41,69.22 104.14,70.48 SV1.1
TDI
  Bottom 0.406: E1.14 69.22,81.28 70.49,82.55 100.97,82.55 109.86,73.66 109.86,62.23 106.05,62.23 104.78,60.96 SV1.9
TDO  (via drill 0.81)
  Top 0.406: v78.74,54.61 89.54,54.61 103.51,68.58 SV1.3
  Bottom 0.406: v78.74,54.61 67.95,54.61 66.68,53.34 E1.71 | U$1.BB2 13.97,76.83 15.24,76.83 17.15,74.93 61.6,74.93 66.68,69.85 102.24,69.85 103.51,68.58 SV1.3
TMS  (via drill 0.81)
  Top 0.406: v66.04,64.77 66.04,70.48 58.42,78.11 E1.23
  Bottom 0.406: v66.04,64.77 100.33,64.77 101.6,66.04 SV1.5
VCC
  Top 0.711: R3.2 86.36,71.12 86.36,70.48 84.46,68.58 C3.1 | E1.66 60.96,48.9 63.5,46.35 C2.1 62.87,45.72 62.87,45.09 C1P.+ | 41.91,55.88 41.91,55.24 43.18,53.98 E1.53 | 41.91,55.88 C1.1 | 41.91,55.88 41.91,64.14 43.18,65.41 E1.43 25.4,66.04 C3P.+ | E1.13 71.12,78.11 68.58,75.56 68.58,59.05 71.12,56.52 E1.78
  Bottom 0.711: C3.1 E1.3 | SV1.4 106.68,69.22 108.59,71.12 108.59,73.03 97.79,73.03 95.89,71.12 R3.2 94.62,71.12 85.73,80.01 69.22,80.01 | 66.68,85.09 57.79,85.09 53.98,81.28 E1.26 | 66.68,85.09 67.95,86.36 C4.1 | 69.22,80.01 70.49,78.74 E1.13 | 69.22,80.01 67.95,80.01 67.31,80.64 67.31,85.09 | 67.31,85.09 66.68,85.09 | 67.31,85.09 82.55,85.09 R1.2 | C1P.+ 22.23,4.45 13.97,4.45 U$1.AA2 | 59.69,53.98 61.6,55.88 E1.78 | 59.69,53.98 59.69,50.8 E1.66 | 17.78,72.39 43.82,72.39 45.09,73.66 E1.38 | 17.78,72.39 16.51,73.66 13.97,73.66 U$1.BA2 | 17.78,72.39 20.96,69.22 22.23,69.22 C3P.+ | 59.69,53.98 48.9,64.77 45.09,64.77 43.82,66.04 E1.43